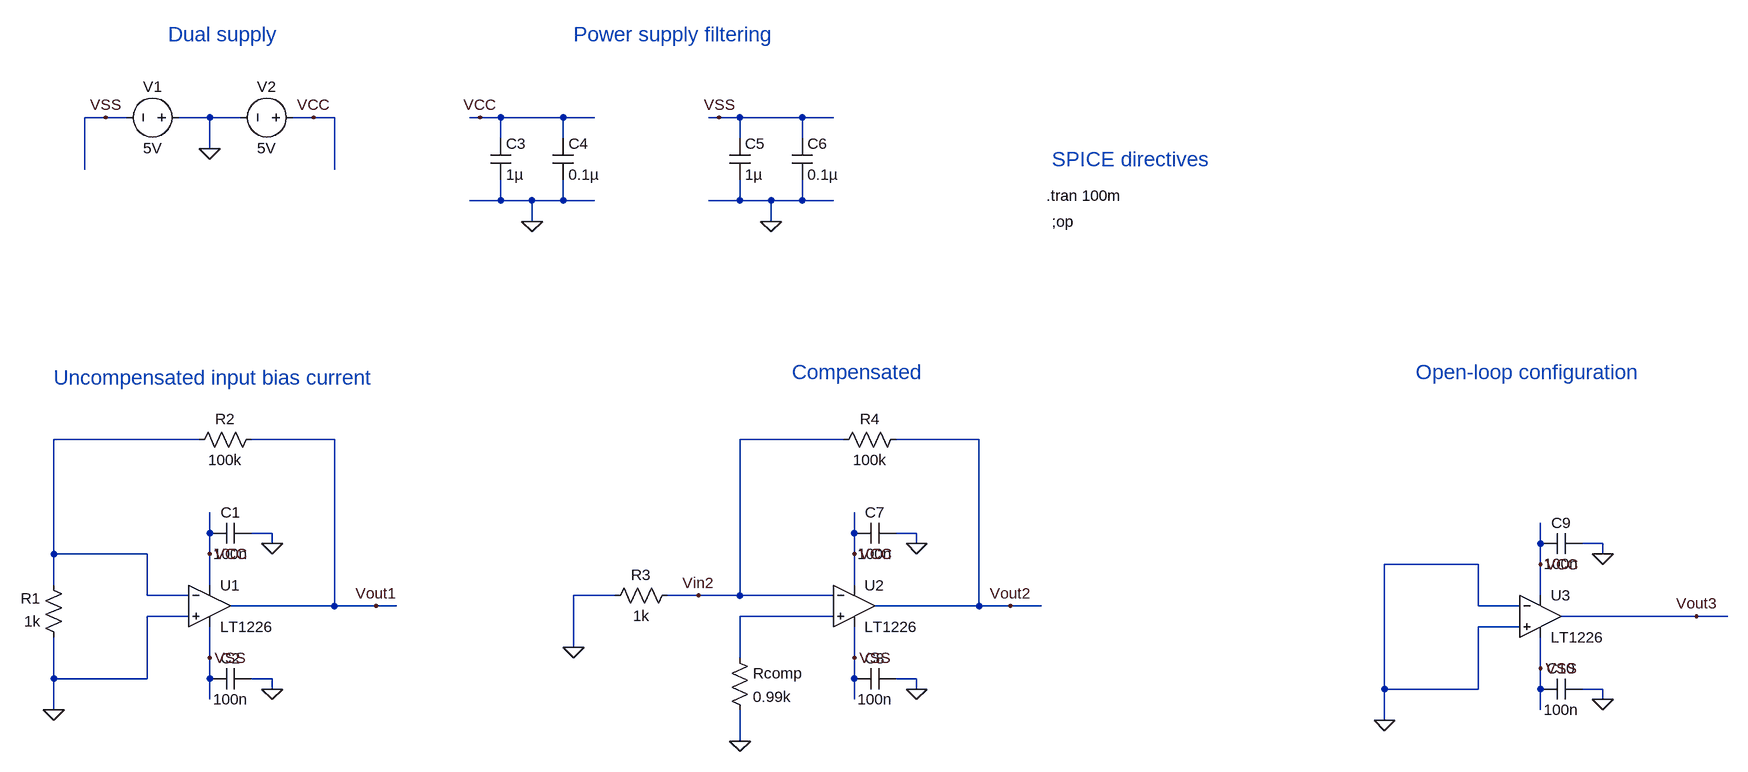
[diagram p0: schematic tb_offset.asc]
tb_offset.asc, the LTspice schematic file:
Version 4
SHEET 1 1688 868
WIRE -816 -208 -848 -208
WIRE -784 -208 -816 -208
WIRE -656 -208 -704 -208
WIRE -608 -208 -656 -208
WIRE -496 -208 -528 -208
WIRE -464 -208 -496 -208
WIRE -240 -208 -256 -208
WIRE -208 -208 -240 -208
WIRE -112 -208 -208 -208
WIRE -64 -208 -112 -208
WIRE 128 -208 112 -208
WIRE 160 -208 128 -208
WIRE 256 -208 160 -208
WIRE 304 -208 256 -208
WIRE -208 -176 -208 -208
WIRE -112 -176 -112 -208
WIRE 160 -176 160 -208
WIRE 256 -176 256 -208
WIRE -656 -160 -656 -208
WIRE -848 -128 -848 -208
WIRE -464 -128 -464 -208
WIRE -208 -80 -208 -112
WIRE -208 -80 -256 -80
WIRE -160 -80 -208 -80
WIRE -112 -80 -112 -112
WIRE -112 -80 -160 -80
WIRE -64 -80 -112 -80
WIRE 160 -80 160 -112
WIRE 160 -80 112 -80
WIRE 208 -80 160 -80
WIRE 256 -80 256 -112
WIRE 256 -80 208 -80
WIRE 304 -80 256 -80
WIRE -160 -48 -160 -80
WIRE 208 -48 208 -80
WIRE -672 288 -896 288
WIRE -464 288 -592 288
WIRE 320 288 160 288
WIRE 528 288 400 288
WIRE -656 432 -656 400
WIRE -560 432 -592 432
WIRE 336 432 336 400
WIRE 432 432 400 432
WIRE -560 448 -560 432
WIRE 432 448 432 432
WIRE 1392 448 1392 416
WIRE 1488 448 1456 448
WIRE -896 464 -896 288
WIRE -752 464 -896 464
WIRE -656 464 -656 432
WIRE 336 464 336 432
WIRE 1488 464 1488 448
WIRE 1296 480 1152 480
WIRE 1392 480 1392 448
WIRE -896 512 -896 464
WIRE -656 512 -656 464
WIRE 336 512 336 464
WIRE -752 528 -752 464
WIRE -688 528 -752 528
WIRE -32 528 -96 528
WIRE 96 528 48 528
WIRE 160 528 160 288
WIRE 160 528 96 528
WIRE 304 528 160 528
WIRE 1392 528 1392 480
WIRE -464 544 -464 288
WIRE -464 544 -624 544
WIRE -400 544 -464 544
WIRE -368 544 -400 544
WIRE 528 544 528 288
WIRE 528 544 368 544
WIRE 576 544 528 544
WIRE 624 544 576 544
WIRE 1296 544 1296 480
WIRE 1360 544 1296 544
WIRE -688 560 -752 560
WIRE 304 560 160 560
WIRE 1632 560 1424 560
WIRE 1680 560 1632 560
WIRE 1360 576 1296 576
WIRE -96 608 -96 528
WIRE -656 624 -656 576
WIRE 160 624 160 560
WIRE 336 624 336 576
WIRE 1392 640 1392 592
WIRE -896 656 -896 592
WIRE -752 656 -752 560
WIRE -752 656 -896 656
WIRE -656 656 -656 624
WIRE -560 656 -592 656
WIRE 336 656 336 624
WIRE 432 656 400 656
WIRE -560 672 -560 656
WIRE 432 672 432 656
WIRE 1152 672 1152 480
WIRE 1296 672 1296 576
WIRE 1296 672 1152 672
WIRE 1392 672 1392 640
WIRE 1488 672 1456 672
WIRE -656 688 -656 656
WIRE 336 688 336 656
WIRE 1488 688 1488 672
WIRE -896 704 -896 656
WIRE 1392 704 1392 672
WIRE 1152 720 1152 672
WIRE 160 752 160 704
FLAG -656 464 VCC
FLAG -656 624 VSS
FLAG -560 448 0
FLAG -560 672 0
FLAG -656 -160 0
FLAG -496 -208 VCC
FLAG -816 -208 VSS
FLAG -160 -48 0
FLAG 208 -48 0
FLAG -240 -208 VCC
FLAG 128 -208 VSS
FLAG 336 464 VCC
FLAG 336 624 VSS
FLAG 432 448 0
FLAG 432 672 0
FLAG 576 544 Vout2
FLAG -96 608 0
FLAG 160 752 0
FLAG -400 544 Vout1
FLAG 96 528 Vin2
FLAG -896 704 0
FLAG 1392 480 VCC
FLAG 1392 640 VSS
FLAG 1488 464 0
FLAG 1488 688 0
FLAG 1632 560 Vout3
FLAG 1152 720 0
SYMBOL Opamps\\LT1226 -656 480 R0
SYMATTR InstName U1
SYMBOL cap -592 416 R90
WINDOW 0 0 32 VBottom 2
WINDOW 3 32 32 VTop 2
SYMATTR InstName C1
SYMATTR Value 100n
SYMBOL cap -592 640 R90
WINDOW 0 0 32 VBottom 2
WINDOW 3 32 32 VTop 2
SYMATTR InstName C2
SYMATTR Value 100n
SYMBOL voltage -688 -208 R90
WINDOW 0 -32 56 VBottom 2
WINDOW 3 32 56 VTop 2
WINDOW 123 0 0 Left 2
WINDOW 39 0 0 Left 2
SYMATTR InstName V1
SYMATTR Value 5V
SYMBOL voltage -512 -208 R90
WINDOW 0 -32 56 VBottom 2
WINDOW 3 32 56 VTop 2
SYMATTR InstName V2
SYMATTR Value 5V
SYMBOL cap -224 -176 R0
SYMATTR InstName C3
SYMATTR Value 1µ
SYMBOL cap -128 -176 R0
SYMATTR InstName C4
SYMATTR Value 0.1µ
SYMBOL cap 144 -176 R0
SYMATTR InstName C5
SYMATTR Value 1µ
SYMBOL cap 240 -176 R0
SYMATTR InstName C6
SYMATTR Value 0.1µ
SYMBOL res -880 608 R180
WINDOW 0 36 76 Left 2
WINDOW 3 36 40 Left 2
SYMATTR InstName R1
SYMATTR Value 1k
SYMBOL res -576 272 R90
WINDOW 0 0 56 VBottom 2
WINDOW 3 32 56 VTop 2
SYMATTR InstName R2
SYMATTR Value 100k
SYMBOL Opamps\\LT1226 336 480 R0
SYMATTR InstName U2
SYMBOL cap 400 416 R90
WINDOW 0 0 32 VBottom 2
WINDOW 3 32 32 VTop 2
SYMATTR InstName C7
SYMATTR Value 100n
SYMBOL cap 400 640 R90
WINDOW 0 0 32 VBottom 2
WINDOW 3 32 32 VTop 2
SYMATTR InstName C8
SYMATTR Value 100n
SYMBOL res 64 512 R90
WINDOW 0 0 56 VBottom 2
WINDOW 3 32 56 VTop 2
SYMATTR InstName R3
SYMATTR Value 1k
SYMBOL res 416 272 R90
WINDOW 0 0 56 VBottom 2
WINDOW 3 32 56 VTop 2
SYMATTR InstName R4
SYMATTR Value 100k
SYMBOL res 144 608 R0
SYMATTR InstName Rcomp
SYMATTR Value 0.99k
SYMBOL Opamps\\LT1226 1392 496 R0
SYMATTR InstName U3
SYMBOL cap 1456 432 R90
WINDOW 0 0 32 VBottom 2
WINDOW 3 32 32 VTop 2
SYMATTR InstName C9
SYMATTR Value 100n
SYMBOL cap 1456 656 R90
WINDOW 0 0 32 VBottom 2
WINDOW 3 32 32 VTop 2
SYMATTR InstName C10
SYMATTR Value 100n
TEXT -720 -336 Left 3 ;Dual supply
TEXT -96 -336 Left 3 ;Power supply filtering
TEXT -896 192 Left 3 ;Uncompensated input bias current
TEXT 632 -88 Left 2 !.tran 100m
TEXT 240 184 Left 3 ;Compensated
TEXT 640 -144 Left 3 ;SPICE directives
TEXT 640 -48 Left 2 !;op
TEXT 1200 184 Left 3 ;Open-loop configuration

The netlist it stands for:
* tb_offset.asc
XU1 0 N001 VCC VSS Vout1 LT1226  ; pins In+ In- V+ V- OUT
C1 0 VCC 100n
C2 0 VSS 100n
V1 0 VSS 5V
V2 VCC 0 5V
C3 VCC 0 1µ
C4 VCC 0 0.1µ
C5 VSS 0 1µ
C6 VSS 0 0.1µ
R1 0 N001 1k
R2 Vout1 N001 100k
XU2 N002 Vin2 VCC VSS Vout2 LT1226  ; pins In+ In- V+ V- OUT
C7 0 VCC 100n
C8 0 VSS 100n
R3 Vin2 0 1k
R4 Vout2 Vin2 100k
Rcomp N002 0 0.99k
XU3 0 0 VCC VSS Vout3 LT1226  ; pins In+ In- V+ V- OUT
C9 0 VCC 100n
C10 0 VSS 100n
* Dual supply
* Power supply filtering
* Uncompensated input bias current
.tran 100m
* Compensated
* SPICE directives
;op
* Open-loop configuration
.backanno
.end